# Altium schematic sheet Trans.SchDoc
size A4
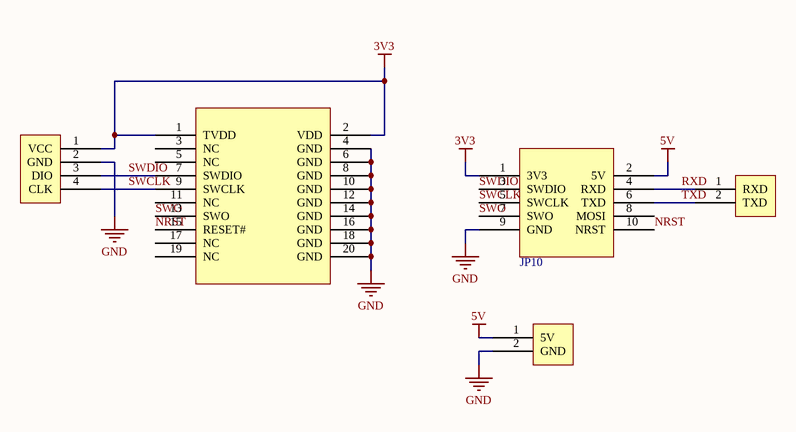
[diagram p0: Trans.SchDoc]

## Parts
J3  JP2  [2Pin]  (value not drawn)
J10Pin  JP10  [10P]
JTAG  JP20  [20P]  (value not drawn)
Pow  Pow5V  [2Pin]  (value not drawn)
SW  JP4  [4Pin]  (value not drawn)

## Nets
3V3: J10Pin.1(3V3) JTAG.1(TVDD) JTAG.2(VDD) SW.1(VCC)
5V: J10Pin.2(5V) Pow.1(5V)
GND: J10Pin.9(GND) JTAG.4(GND) JTAG.6(GND) JTAG.8(GND) JTAG.10(GND) JTAG.12(GND) JTAG.14(GND) JTAG.16(GND) JTAG.18(GND) JTAG.20(GND) Pow.2(GND) SW.2(GND)
NRST: J10Pin.10(NRST) JTAG.15(RESET#)
RXD: J3.1(RXD) J10Pin.4(RXD)
SWCLK: J10Pin.5(SWCLK) JTAG.9(SWCLK) SW.4(CLK)
SWDIO: J10Pin.3(SWDIO) JTAG.7(SWDIO) SW.3(DIO)
SWO: J10Pin.7(SWO) JTAG.13(SWO)
TXD: J3.2(TXD) J10Pin.6(TXD)

Not connected (* = marked no-connect by the designer): J10Pin 8(MOSI); JTAG 3(NC) 5(NC) 11(NC) 17(NC) 19(NC)